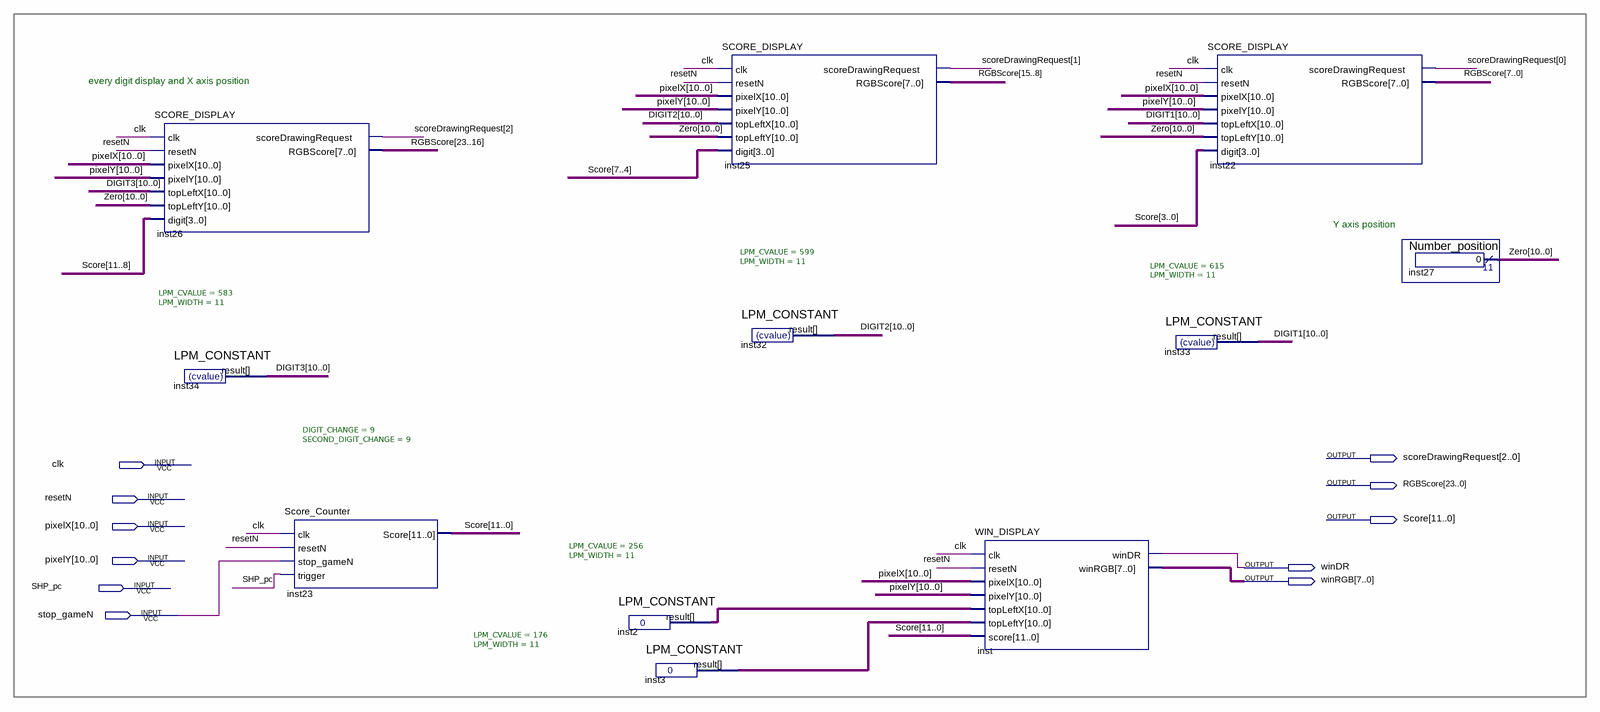
[diagram p0: schematic sheet]
// Quartus schematic SCORE_TOP.bdf as structural Verilog: 11 symbols, 11 pins
module SCORE_TOP (
  input  clk,
  input  resetN,
  input  [10:0] pixelX,
  input  [10:0] pixelY,
  input  SHP_pc,
  input  stop_gameN,
  output [2:0] scoreDrawingRequest,
  output [23:0] RGBScore,
  output [11:0] Score,
  output winDR,
  output [7:0] winRGB
);

  wire [10:0] DIGIT1, DIGIT2, DIGIT3, inst2_result, inst3_result, Zero;

  SCORE_DISPLAY inst26 (
    .clk(clk), .resetN(resetN), .pixelX(pixelX), .pixelY(pixelY), .topLeftX(DIGIT3), .topLeftY(Zero),
    .digit(Score[11:8]), .scoreDrawingRequest(scoreDrawingRequest[2]), .RGBScore(RGBScore[23:16]));
  LPM_CONSTANT #(.LPM_CVALUE(583), .LPM_WIDTH(11)) inst34 (.result(DIGIT3));
  Score_Counter #(.DIGIT_CHANGE(9), .SECOND_DIGIT_CHANGE(9)) inst23 (
    .clk(clk), .resetN(resetN), .stop_gameN(stop_gameN), .trigger(SHP_pc), .Score(Score));
  LPM_CONSTANT #(.LPM_CVALUE(256), .LPM_WIDTH(11)) inst2 (.result(inst2_result));
  LPM_CONSTANT #(.LPM_CVALUE(176), .LPM_WIDTH(11)) inst3 (.result(inst3_result));
  SCORE_DISPLAY inst25 (
    .clk(clk), .resetN(resetN), .pixelX(pixelX), .pixelY(pixelY), .topLeftX(DIGIT2), .topLeftY(Zero),
    .digit(Score[7:4]), .scoreDrawingRequest(scoreDrawingRequest[1]), .RGBScore(RGBScore[15:8]));
  LPM_CONSTANT #(.LPM_CVALUE(599), .LPM_WIDTH(11)) inst32 (.result(DIGIT2));
  WIN_DISPLAY inst (
    .clk(clk), .resetN(resetN), .pixelX(pixelX), .pixelY(pixelY), .topLeftX(inst2_result),
    .topLeftY(inst3_result), .score(Score), .winDR(winDR), .winRGB(winRGB));
  LPM_CONSTANT #(.LPM_CVALUE(615), .LPM_WIDTH(11)) inst33 (.result(DIGIT1));
  SCORE_DISPLAY inst22 (
    .clk(clk), .resetN(resetN), .pixelX(pixelX), .pixelY(pixelY), .topLeftX(DIGIT1), .topLeftY(Zero),
    .digit(Score[3:0]), .scoreDrawingRequest(scoreDrawingRequest[0]), .RGBScore(RGBScore[7:0]));
  Number_position inst27 (.result(Zero));

  // Notes on the sheet:
  //   every digit display and X axis position
  //   Y axis position
endmodule
